# EAGLE design mippe_base_v2 (EAGLE 9.5.0)
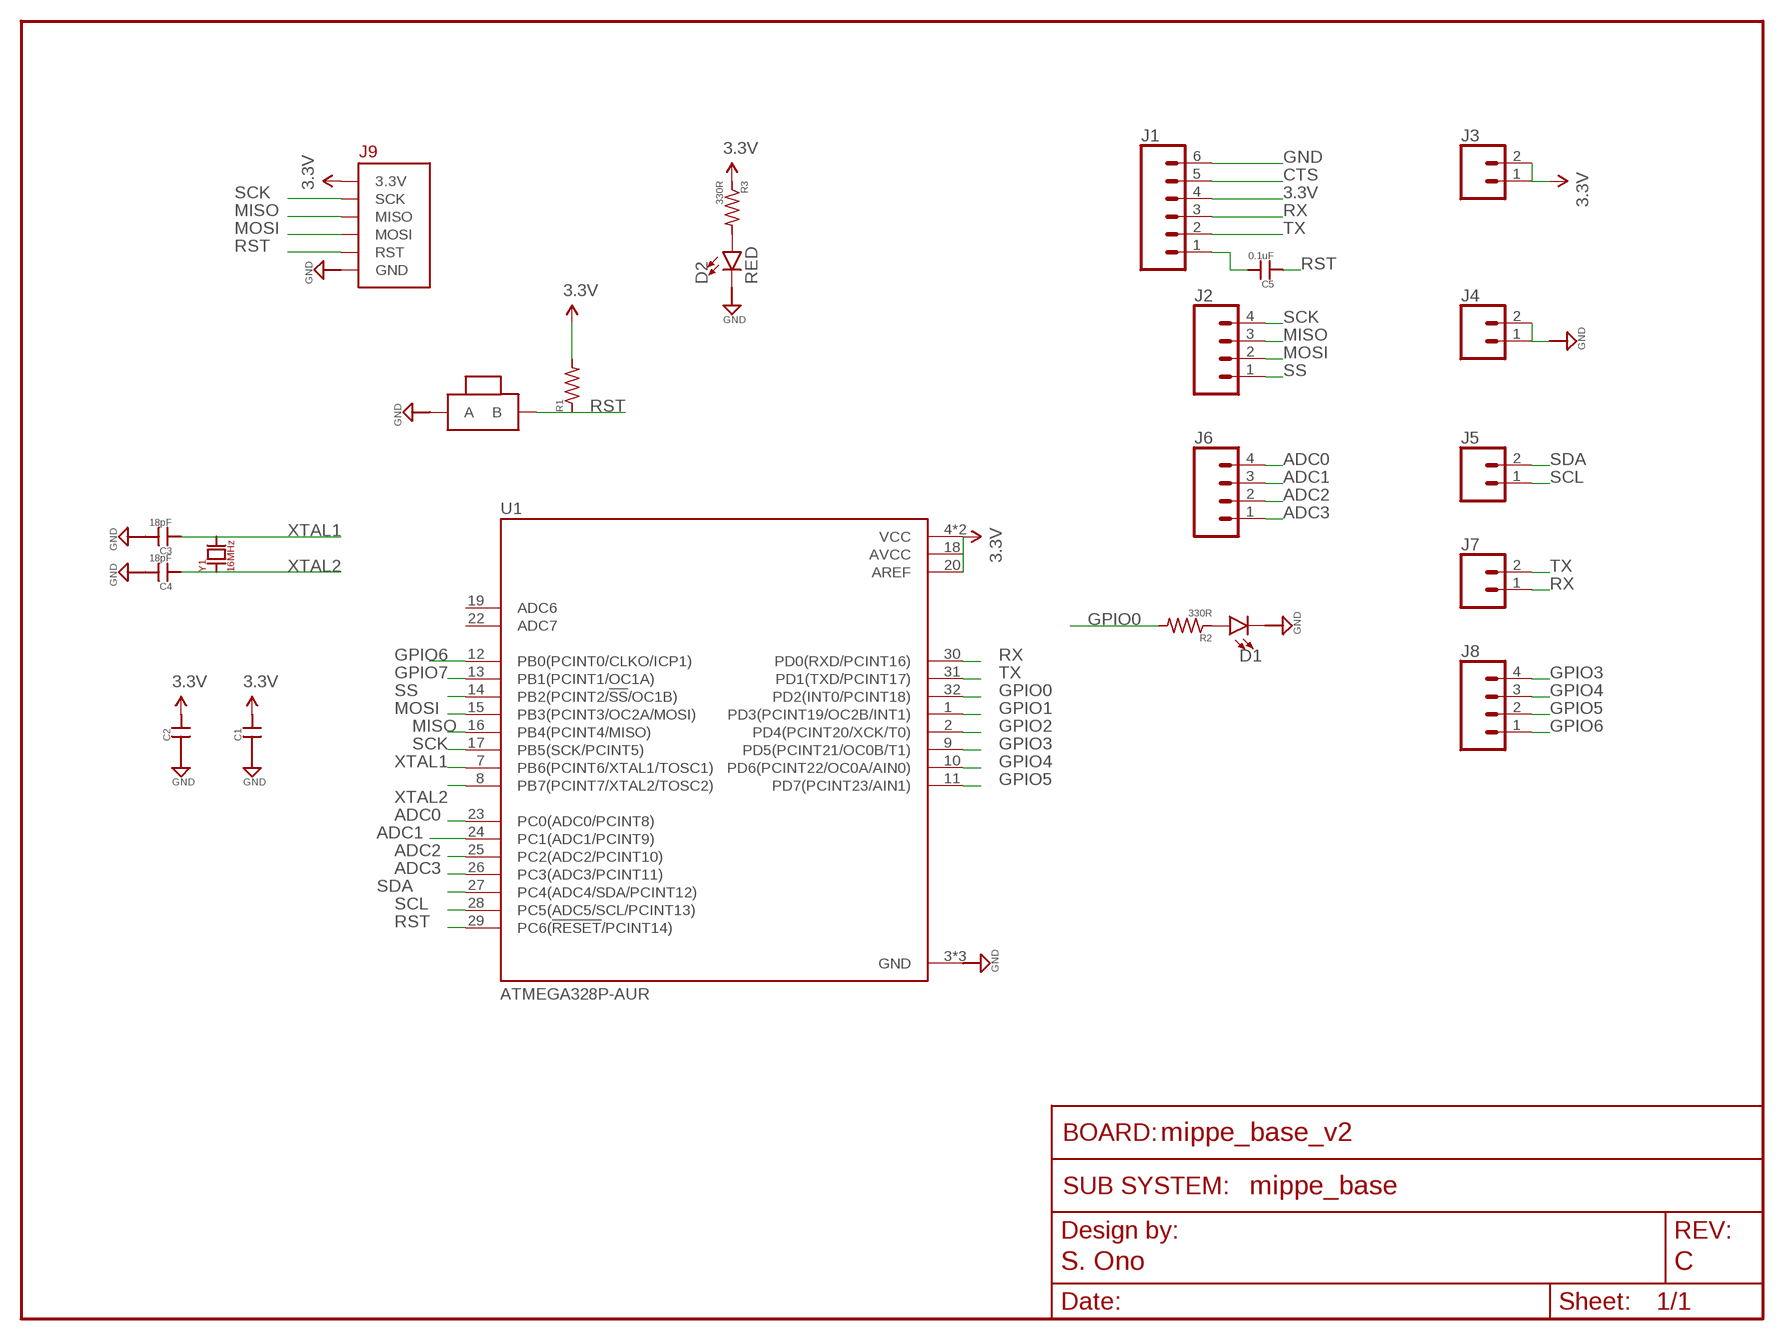
[diagram p0: schematic, sheet 1]
FRAME1 (FRAME_SCHEMATIC): AUTHOR: S. Ono; REV: C; SUBSYSTEM_NAME: mippe_base

## Parts
C1  CAP0603-CAP  [0603-CAP]
C2  CAP0603-CAP  [0603-CAP]
C3  18pF  CAP0603-CAP  [0603-CAP]
C4  18pF  CAP0603-CAP  [0603-CAP]
C5  0.1uF  CAP0603-CAP  [0603-CAP]
D1  LED0603  [LED-0603]
D2  RED  LED0603  [LED-0603]
J1  CONN_06NO_SILK_FEMALE_PTH  [1X06_NO_SILK]
J2  CONN_041X04_NO_SILK  [1X04_NO_SILK]
J3  CONN_021X02_NO_SILK  [1X02_NO_SILK]
J4  CONN_021X02_NO_SILK  [1X02_NO_SILK]
J5  CONN_021X02_NO_SILK  [1X02_NO_SILK]
J6  CONN_041X04_NO_SILK  [1X04_NO_SILK]
J7  CONN_021X02_NO_SILK  [1X02_NO_SILK]
J8  CONN_041X04_NO_SILK  [1X04_NO_SILK]
J9  BURNIN  [BURNIN]
R1  R-US_R0603  [R0603]
R2  330R  R-US_R0603  [R0603]
R3  330R  R-US_R0603  [R0603]
SW1  BTN-PTS810  [BTN_PTS810]
U1  ATMEGA328P-AUR  [QFP80P900X900X120-32N]
Y1  16MHz  CRYSTAL_SMOL  [XTAL500X320X130N]

## Nets
3.3V: C1.2 C2.2 J1.4 J3.1 J3.2 J9.3.3V R1.2 R3.1 U1.4(VCC) U1.6(VCC) U1.18(AVCC) U1.20(AREF)
ADC0: J6.4 U1.23(PC0(ADC0/PCINT8))
ADC1: J6.3 U1.24(PC1(ADC1/PCINT9))
ADC2: J6.2 U1.25(PC2(ADC2/PCINT10))
ADC3: J6.1 U1.26(PC3(ADC3/PCINT11))
CTS: J1.5
GND: C1.1 C2.1 C3.2 C4.2 D1.C D2.C J1.6 J4.1 J4.2 J9.GND SW1.1(A) SW1.2(A) U1.3(GND) U1.5(GND) U1.21(GND)
GPIO0: R2.2 U1.32(PD2(INT0/PCINT18))
GPIO1: U1.1(PD3(PCINT19/OC2B/INT1))
GPIO2: U1.2(PD4(PCINT20/XCK/T0))
GPIO3: J8.4 U1.9(PD5(PCINT21/OC0B/T1))
GPIO4: J8.3 U1.10(PD6(PCINT22/OC0A/AIN0))
GPIO5: J8.2 U1.11(PD7(PCINT23/AIN1))
GPIO6: J8.1 U1.12(PB0(PCINT0/CLKO/ICP1))
GPIO7: U1.13(PB1(PCINT1/OC1A))
MISO: J2.3 J9.MISO U1.16(PB4(PCINT4/MISO))
MOSI: J2.2 J9.MOSI U1.15(PB3(PCINT3/OC2A/MOSI))
N$1: D1.A R2.1
N$2: D2.A R3.2
N$3: C5.2 J1.1
RST: C5.1 J9.RST R1.1 SW1.3(B) SW1.4(B) U1.29(PC6(!RESET!/PCINT14))
RX: J1.3 J7.1 U1.30(PD0(RXD/PCINT16))
SCK: J2.4 J9.SCK U1.17(PB5(SCK/PCINT5))
SCL: J5.1 U1.28(PC5(ADC5/SCL/PCINT13))
SDA: J5.2 U1.27(PC4(ADC4/SDA/PCINT12))
SS: J2.1 U1.14(PB2(PCINT2/!SS!/OC1B))
TX: J1.2 J7.2 U1.31(PD1(TXD/PCINT17))
XTAL1: C3.1 U1.7(PB6(PCINT6/XTAL1/TOSC1)) Y1.2(B)
XTAL2: C4.1 U1.8(PB7(PCINT7/XTAL2/TOSC2)) Y1.1(A)
Unconnected: U1.19(ADC6) U1.22(ADC7)

## Library data of the parts
C1-C5 = scono:CAP: Capacitor Standard 0603 ceramic capacitor, and 0.1" leaded capacitor.; PIE-INT-REF-NUM: CAPACITOR-GENERIC
D1 D2 = scono:LED: https://www.digikey.com/products/en/optoelectronics/led-indication-discrete/105?k=&pkeyword=&pv7=2&pv1989=0&pv16=5&FV=ffe00069&quantity=0&ColumnSort=0&page=1&pageSize=25
J1 = scono:CONN_06: Multi connection point. Often used as Generic Header-pin footprint for 0.1 inch spaced/style header connections On any of the 0.1 inch spaced packages, you can populate with these: Break Away Headers - Straight <https://www.sparkfun.com/products/116> (PRT-00116) Break Away Male Headers - Right Angle <https://www.sparkfun.com/products/553> (PRT-00553) Female Headers <https://www.sparkfun.com/products/115> (PRT-00115) Break Away Headers - Machine Pin <https://www.sparkfun.com/products/117> (PRT-00117) Break Away Female Headers - Swiss Machine Pin <https://www.sparkfun.com/products/743> (PRT-00743) Arduino Stackable Header - 6 Pin <https://www.sparkfun.com/products/9280> (PRT-09280) For SCREWTERMINALS and SPRING TERMINALS visit here: Screw Terimnals on SparkFun.com <https://www.sparkfun.com/search/results?term=Screw+Terminals> (5mm/3.5mm/2.54mm spacing) This device is also useful as a general connection point to wire up your design to another part of your project. Our various solder wires solder well into these plated through hole pads. Hook-Up Wire - Assortment (Stranded, 22 AWG) <https://www.sparkfun.com/products/11375> (PRT-11375) Hook-Up Wire - Assortment (Solid Core, 22 AWG) <https://www.sparkfun.com/products/11367> (PRT-11367) View the entire wire category on our website here <https://www.sparkfun.com/categories/141>; PROD_ID: CONN-08437
J2 J6 J8 = scono:CONN_04: Multi connection point. Often used as Generic Header-pin footprint for 0.1 inch spaced/style header connections On any of the 0.1 inch spaced packages, you can populate with these: Break Away Headers - Straight <https://www.sparkfun.com/products/116> (PRT-00116) Break Away Male Headers - Right Angle <https://www.sparkfun.com/products/553> (PRT-00553) Female Headers <https://www.sparkfun.com/products/115> (PRT-00115) Break Away Headers - Machine Pin <https://www.sparkfun.com/products/117> (PRT-00117) Break Away Female Headers - Swiss Machine Pin <https://www.sparkfun.com/products/743> (PRT-00743) For SCREWTERMINALS and SPRING TERMINALS visit here: Screw Terimnals on SparkFun.com <https://www.sparkfun.com/search/results?term=Screw+Terminals> (5mm/3.5mm/2.54mm spacing) This device is also useful as a general connection point to wire up your design to another part of your project. Our various solder wires solder well into these plated through hole pads. Hook-Up Wire - Assortment (Stranded, 22 AWG) <https://www.sparkfun.com/products/11375> (PRT-11375) Hook-Up Wire - Assortment (Solid Core, 22 AWG) <https://www.sparkfun.com/products/11367> (PRT-11367) View the entire wire category on our website here <https://www.sparkfun.com/categories/141> Special notes: Molex polarized connector foot print use with SKU : PRT-08231 with associated crimp pins and housings. 1MM SMD Version SKU: PRT-10208; PROD_ID: CONN-09696
J3-J5 J7 = scono:CONN_02: Multi connection point. Often used as Generic Header-pin footprint for 0.1 inch spaced/style header connections On any of the 0.1 inch spaced packages, you can populate with these: Break Away Headers - Straight <https://www.sparkfun.com/products/116> (PRT-00116) Break Away Male Headers - Right Angle <https://www.sparkfun.com/products/553> (PRT-00553) Female Headers <https://www.sparkfun.com/products/115> (PRT-00115) Break Away Headers - Machine Pin <https://www.sparkfun.com/products/117> (PRT-00117) Break Away Female Headers - Swiss Machine Pin <https://www.sparkfun.com/products/743> (PRT-00743) For SCREWTERMINALS and SPRING TERMINALS visit here: Screw Terimnals on SparkFun.com <https://www.sparkfun.com/search/results?term=Screw+Terminals> (5mm/3.5mm/2.54mm spacing) This device is also useful as a general connection point to wire up your design to another part of your project. Our various solder wires solder well into these plated through hole pads. Hook-Up Wire - Assortment (Stranded, 22 AWG) <https://www.sparkfun.com/products/11375> (PRT-11375) Hook-Up Wire - Assortment (Solid Core, 22 AWG) <https://www.sparkfun.com/products/11367> (PRT-11367) View the entire wire category on our website here <https://www.sparkfun.com/categories/141> Special notes: Molex polarized connector foot print use with: PRT-08233 with associated crimp pins and housings. 2.54_SCREWTERM for use with PRT-10571. 3.5mm Screw Terminal footprints for PRT-08084 5mm Screw Terminal footprints for use with PRT-08432
J9 = scono:BURNIN
R1-R3 = scono:R-US_: RESISTOR, American symbol; DESCRIPTION: RESISTOR, American symbol; DISTRIBUTOR: DigiKey; MANUFACTURER: Rohm Semiconductor; NOTES: Cut Tape; PACKAGE: R0603
SW1 = scono:BTN-PTS810: https://www.digikey.com/product-detail/en/c-k/PTS810-SJM-250-SMTR-LFS/CKN10502CT-ND/4176673
U1 = scono:ATMEGA328P-AUR: ATmega328P Series 8 Bit 2 kB RAM 32 kB Flash SMT Microcontroller - TQFP-32; DESCRIPTION: ATmega328P Series 8 Bit 2 kB RAM 32 kB Flash SMT Microcontroller - TQFP-32; DIGI-KEY_PART_NUMBER: ATMEGA328P-AURCT-ND; DIGI-KEY_PURCHASE_URL: https://www.digikey.com/product-detail/en/microchip-technology/ATMEGA328P-AUR/ATMEGA328P-AURCT-ND/3789455?utm_source=snapeda&utm_medium=aggregator&utm_campaign=symbol; MF: Microchip; MP: ATMEGA328P-AUR; PACKAGE: TQFP-32 Microchip
Y1 = scono:CRYSTAL

## Board
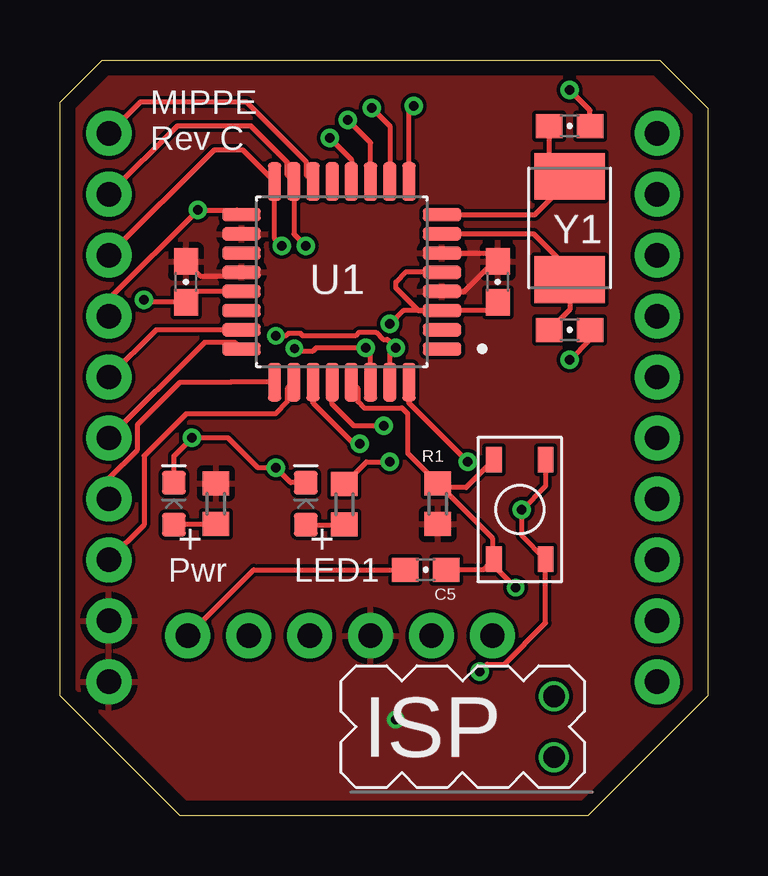
[diagram p1: board, top side]
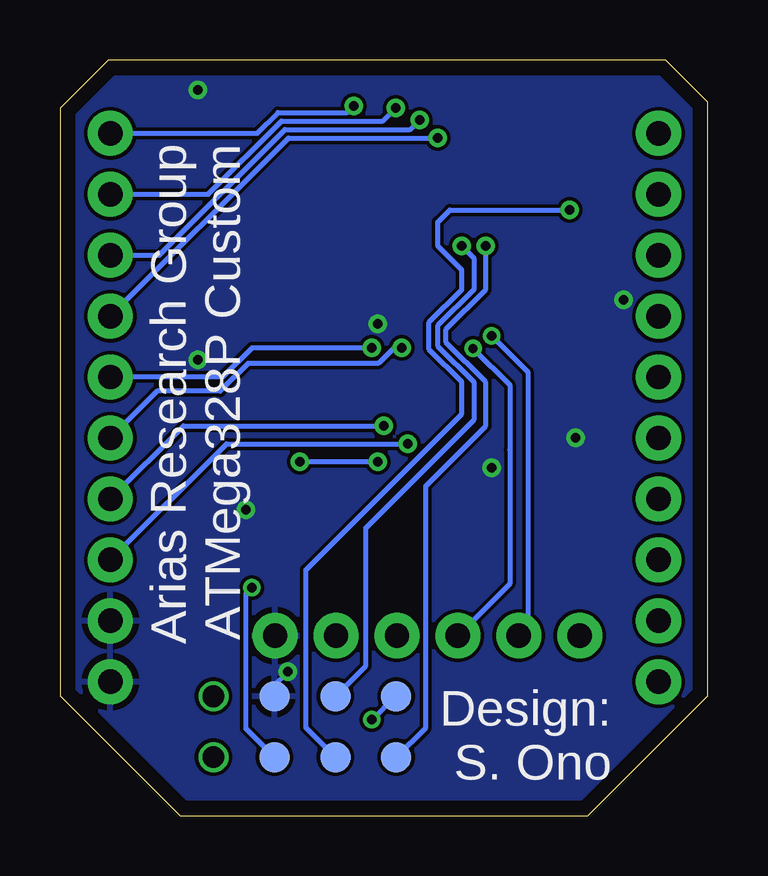
[diagram p2: board, bottom side, seen from below]

Size 27 x 31.5 mm. Coordinates in mm from the lower left corner, seen from the top.
Outline: 0,29.75 1.75,31.5 6.5,31.5 25,31.5 27,29.5 27,5 22,0 5,0 0,5 0,29.75
Copper layers (1*16): Top 2mil / dielectric 9mil / Bottom 2mil
Design rules "scono": minimum track width 6mil, minimum drill 15mil, track to track 6mil, track to pad 6mil, pad to pad 6mil, via to via 6mil, smd to smd 6mil, copper to edge 25mil, drill to drill 7mil, minimum pad ring 7mil, minimum via ring 7mil, stop-mask expansion 3mil, vias tented up to drill 0mil, thermal gap 10mil

### Footprints (pad centres in the part's own frame; a part is rotated, then mirrored left to right if it is on the bottom)
0603-CAP = smd 1.1 x 1: 1 -0.85,0; 2 0.85,0
LED-0603 = smd 1 x 1: A -0.877,0; C 0.877,0
1X06_NO_SILK = drill 1.016 pad 1.88: 1 0,0; 2 2.54,0; 3 5.08,0; 4 7.62,0; 5 10.16,0; 6 12.7,0
1X04_NO_SILK = drill 1.016 pad 1.88: 1 0,0; 2 2.54,0; 3 5.08,0; 4 7.62,0
1X02_NO_SILK = drill 1.016 pad 1.88: 1 0,0; 2 2.54,0
BURNIN = smd 1.27 x 1.27 bottom: 3.3V 0,0; GND -5.08,0; MISO 0,2.54; MOSI -2.54,0; RST -5.08,2.54; SCK -2.54,2.54 | drill 0.9: P$7 -7.62,2.54; P$8 -7.62,0
R0603 = smd 1 x 1.1: 1 -0.85,0; 2 0.85,0
BTN_PTS810 = smd 1.05 x 0.65: 1 -2.075,1.075; 2 2.075,1.075; 3 -2.075,-1.075; 4 2.075,-1.075
QFP80P900X900X120-32N = smd 1.6 x 0.55: 1 -4.18,2.8; 2 -4.18,2; 3 -4.18,1.2; 4 -4.18,0.4; 5 -4.18,-0.4; 6 -4.18,-1.2; 7 -4.18,-2; 8 -4.18,-2.8; 17 4.18,-2.8; 18 4.18,-2; 19 4.18,-1.2; 20 4.18,-0.4; 21 4.18,0.4; 22 4.18,1.2; 23 4.18,2; 24 4.18,2.8 | smd 0.55 x 1.6: 9 -2.8,-4.18; 10 -2,-4.18; 11 -1.2,-4.18; 12 -0.4,-4.18; 13 0.4,-4.18; 14 1.2,-4.18; 15 2,-4.18; 16 2.8,-4.18; 25 2.8,4.18; 26 2,4.18; 27 1.2,4.18; 28 0.4,4.18; 29 -0.4,4.18; 30 -1.2,4.18; 31 -2,4.18; 32 -2.8,4.18
XTAL500X320X130N = smd 1.95 x 2.95: 1 -2.15,0; 2 2.15,0

### Placement (x,y rotation side)
C1  18.25,22.25 90 top
C2  5.25,22.25 90 top
C3  21.25,20.25 0 top
C4  21.25,28.75 0 top
C5  15.25,10.25 180 top
D1  10.25,13 90 top
D2  4.75,13 90 top
J1  5.33,7.5 0 top
J2  2.04,28.44 270 top
J3  2.04,5.58 90 top
J4  24.9,5.58 90 top
J5  24.9,13.2 270 top
J6  2.04,10.66 90 top
J7  24.9,15.74 90 top
J8  24.9,20.82 90 top
J9  12.98,4.97 180 top
R1  15.75,13 270 top
R2  11.86,12.98 90 top
R3  6.5,13 270 top
SW1  19.17,12.76 270 top
U1  11.75,22.25 180 top
Y1  21.25,24.5 270 top

### Tracks (layer width: path | path; a pad name or v marks a point on that pad's centre or on a via)
3.3V  (via drill 0.38)
  Top 0.2: U1.6 17.9,23.45 18.18,23.18 | 18.18,23.18 C1.2 | U1.4 16.85,21.85 18.18,23.18 | C2.2 5.85,22.5 7.42,22.5 U1.20
  Bottom 0.2: J9.3.3V 13.03,4.97 v14,4
  pour Top: 0.5,29.5 2,31 25,31 26.5,29.5 26.5,5 22,0.5 5,0.5 0.5,5
ADC0
  Top 0.2: U1.23 4.01,20.25 J6.4
ADC1
  Top 0.2: J6.3 6.02,19.72 7.3,19.72 U1.24
ADC2
  Top 0.2: U1.25 7.12,18.07 5,18.07 3.23,16.3 3.23,15.25 2.04,14.05 J6.2
ADC3
  Top 0.2: U1.26 9.48,17.8 9.48,17.25 8.98,16.75 5.25,16.75 3.5,15 3.5,12.12 J6.1
GND  (via drill 0.4)
  Top 0.2: C3.2 22.1,19.85 v21.25,19 | C4.2 22.1,29.4 v21.25,30.25 | C1.1 17.9,21.05 U1.3 | U1.5 14.4,22.65 14,22.25 14,22 14.95,21.05 U1.3 | U1.3 14.3,21.05 v13.75,20.5 | U1.21 5.7,21.85 C2.1 3.6,21.4 v3.5,21.5 | v17.5,6 17.81,6.31 18.52,6.31 20.25,8.03 SW1.2 19.25,11.68 v19.25,12.75 20.25,13.74 SW1.1 | D1.C 9.62,13.88 v9,14.5 8.25,14.5 7,15.75 v5.5,15.75 4.75,15 D2.C
  Bottom 0.2: J9.GND 18.06,5.44 v17.5,6
  pour Bottom: 0.5,5 0.5,29.5 2,31 25,31 26.5,29.5 26.5,5 22,0.5 5,0.5
GPIO0  (via drill 0.4)
  Top 0.2: R2.2 12.78,14.75 v13.75,14.75 | v17,14.75 14.55,17.2 U1.32
  Bottom 0.2: v13.75,14.75 v17,14.75
GPIO3  (via drill 0.4)
  Top 0.2: U1.9 14.55,29.39 v14.75,29.59
  Bottom 0.2: J8.4 18.77,28.44 17.91,29.31 15.03,29.31 v14.75,29.59
GPIO4  (via drill 0.4)
  Top 0.2: v13,29.5 13.75,28.75 U1.10
  Bottom 0.2: J8.3 20.82,25.9 17.76,28.95 13.54,28.95 v13,29.5
GPIO5  (via drill 0.4)
  Top 0.2: U1.11 12.95,28.05 v12,29
  Bottom 0.2: J8.2 22.86,23.36 17.62,28.6 12.4,28.6 v12,29
GPIO6  (via drill 0.4)
  Top 0.2: v11.25,28.25 12.15,27.35 U1.12
  Bottom 0.2: J8.1 17.47,28.25 v11.25,28.25
MISO  (via drill 0.4)
  Top 0.2: v9.25,23.75 8.95,24.05 U1.16 7.63,27.75 6.43,27.75 J2.3
  Bottom 0.2: J9.MISO 11.75,3.66 11.75,8.75 11.75,13.75 9.25,16.25 9.25,18.07 10.91,19.73 10.91,20.27 9.25,21.93 v9.25,23.75
MOSI  (via drill 0.4)
  Top 0.2: v10.25,23.75 9.75,24.25 U1.15 9.48,26.7 9.48,27.25 7.98,28.75 4.89,28.75 J2.2
  Bottom 0.2: J9.MOSI 14.25,6.24 14.25,12 9.75,16.5 9.75,18.07 11.26,19.58 11.26,20.42 9.75,21.93 9.75,23.25 v10.25,23.75
N$1
  Top 0.2: D1.A R2.1
N$2
  Top 0.2: D2.A 4.78,12.15 R3.2
N$3
  Top 0.2: J1.1 8.08,10.25 C5.2
RST  (via drill 0.38)
  Top 0.2: 18.03,10.62 SW1.4 17.66,10.25 C5.1 | U1.29 12.42,17.8 12.42,17.25 12.67,17 14.25,17 14.5,16.75 14.5,15.1 R1.1 15.93,13.68 | 15.93,13.68 18.03,11.57 18.03,10.62 | SW1.3 16.93,13.68 15.93,13.68 | v19,9.5 18.03,10.47 18.03,10.62
  Bottom 0.2: J9.RST 19.25,3.62 19.25,9.25 v19,9.5
RX  (via drill 0.38, 0.4)
  Top 0.2: U1.30 12.95,19.3 v12.75,19.5 10.68,19.5 10.52,19.34 10,19.34 | 10,19.34 9.91,19.34 | 10,19.34 9.91,19.34 | 9.91,19.34 v9.78,19.48
  Bottom 0.2: v12.75,19.5 13.07,19.5 13.73,18.84 19.16,18.84 20.31,17.69 22.95,17.69 J7.1 | v9.78,19.48 8.25,17.95 8.25,15.25 8.25,9.66 J1.3
SCK  (via drill 0.4)
  Top 0.2: U1.17 7.37,25.25 v5.75,25.25 2.04,21.54 J2.4
  Bottom 0.2: J9.SCK 16.75,3.66 16.75,10.25 10.25,16.75 10.25,18.08 11.61,19.44 11.61,20.56 10.25,21.92 10.25,22.75 11.25,23.75 11.25,24.75 10.75,25.25 v5.75,25.25
SCL  (via drill 0.4)
  Top 0.2: v13.5,16.25 12.25,16.25 11.35,17.15 U1.28
  Bottom 0.2: J5.1 21.85,16.25 v13.5,16.25
SDA  (via drill 0.4)
  Top 0.2: U1.27 10.55,17.2 12.25,15.5 v12.5,15.5
  Bottom 0.2: J5.2 20.06,15.5 v12.5,15.5
SS
  Top 0.2: U1.14 10.28,26.7 10.28,27.25 7.78,29.75 3.35,29.75 J2.1
TX  (via drill 0.38, 0.4)
  Top 0.2: U1.31 13.75,19.25 v14,19.5 13.66,19.84 13.48,19.84 13.17,20.16 12.48,20.16 12.32,20 10.13,20 10.03,20.1 9.52,20.1 9.42,20 v9,20
  Bottom 0.2: v14,19.5 19,19.5 20.22,18.28 J7.2 | v9,20 7.5,18.5 7.5,7.87 J1.2
XTAL1
  Top 0.2: C3.1 21.25,21.1 Y1.2 21.25,22.75 19.75,24.25 U1.7
XTAL2
  Top 0.2: C4.1 20.4,27.5 Y1.1 21.25,26.5 19.8,25.05 U1.8

### Text on the board
tPlace: MIPPE / Rev C | Pwr | LED1
bPlace: Arias Research Group / ATMega328P Custom | Design: / S. Ono